# EAGLE design Adafruit USB Host FeatherWing (EAGLE 9.6.2)

## Sheet 1 of 2
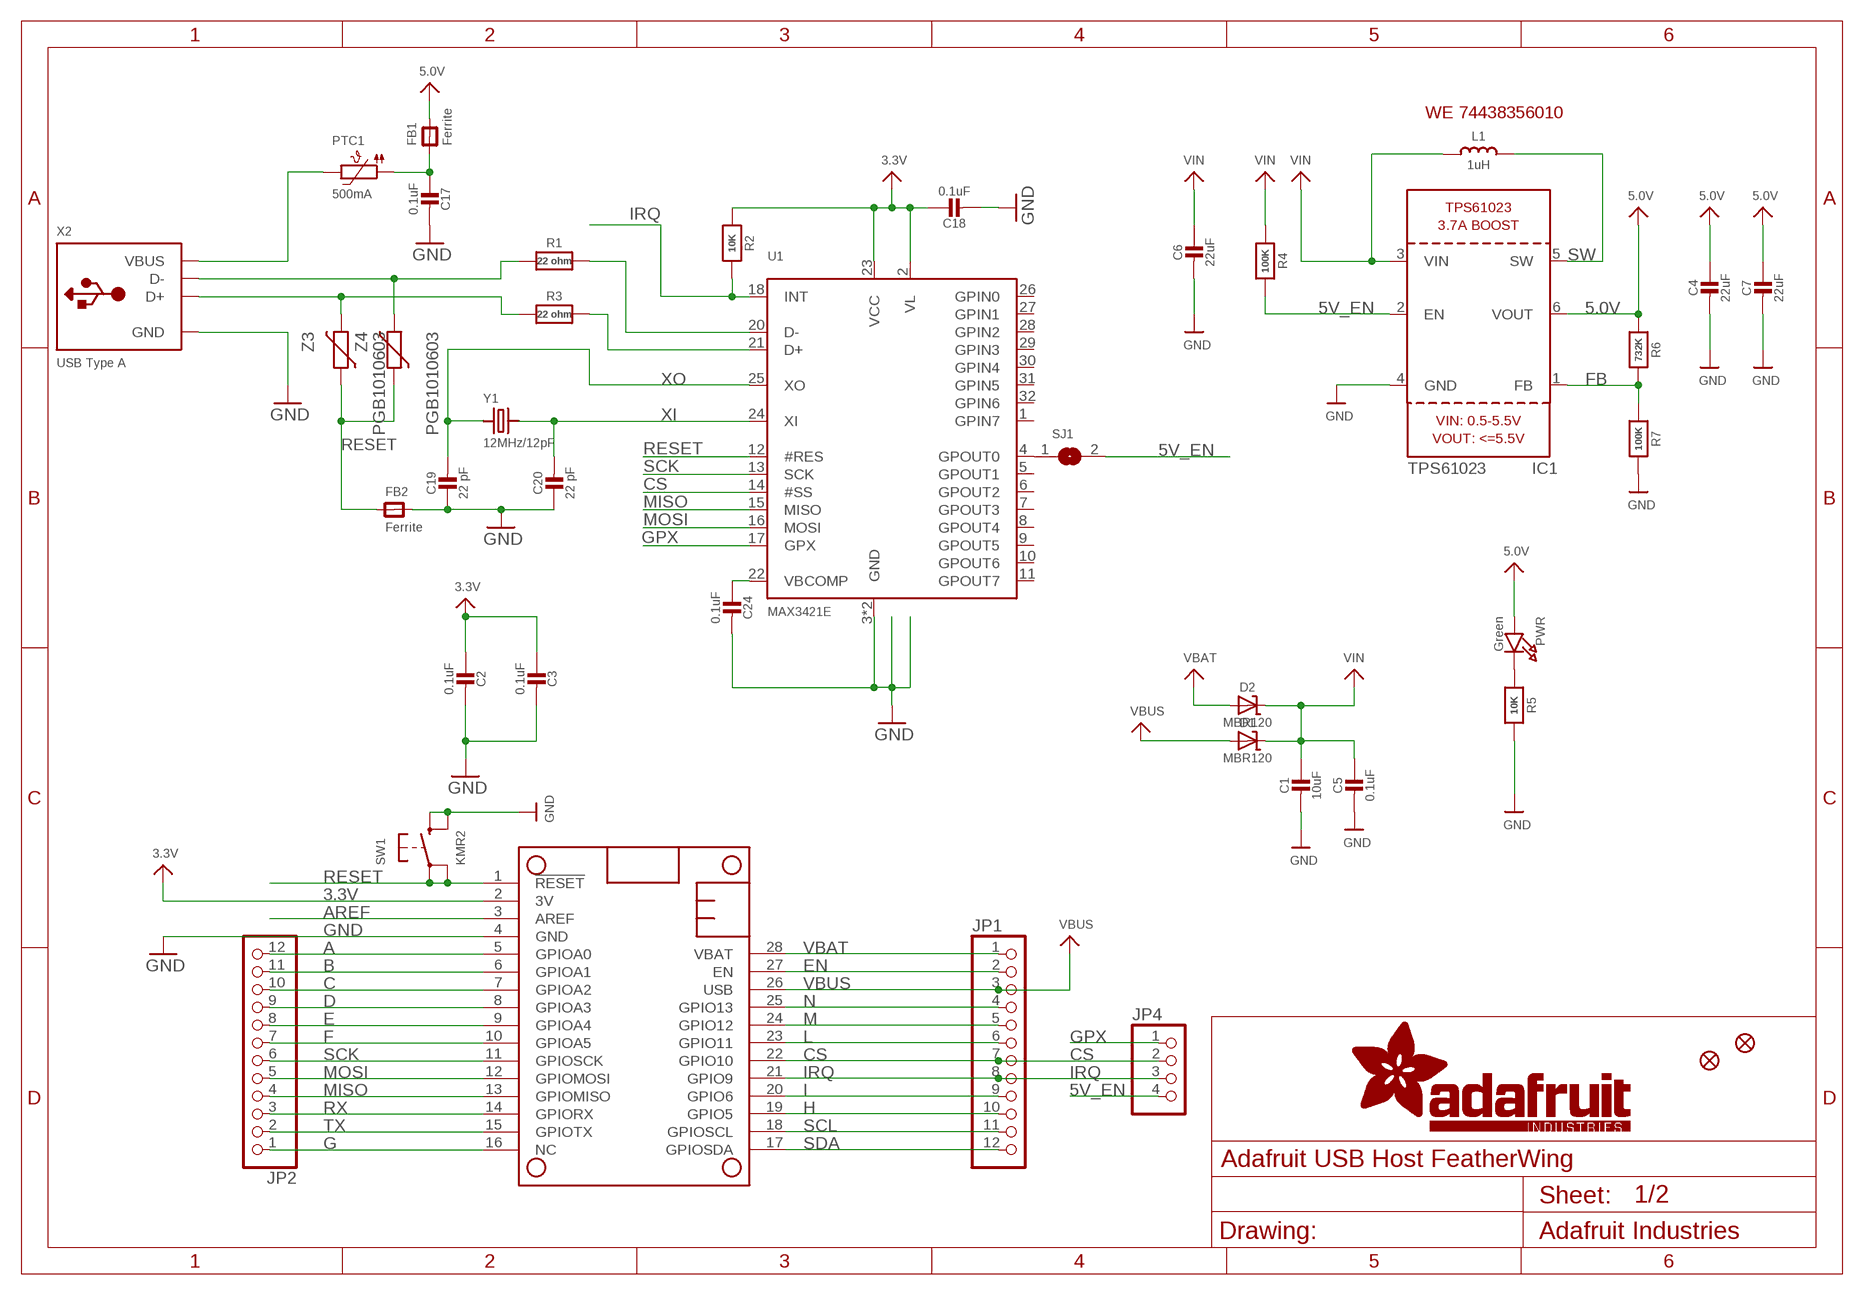
[diagram p0: schematic, sheet 1]

### Parts
C1  10uF  CAP_CERAMIC0805-NOOUTLINE  [0805-NO]
C2  0.1uF  CAP_CERAMIC0603_NO  [0603-NO]
C3  0.1uF  CAP_CERAMIC0603_NO  [0603-NO]
C4  22uF  CAP_CERAMIC0805-NOOUTLINE  [0805-NO]
C5  0.1uF  CAP_CERAMIC0603_NO  [0603-NO]
C6  22uF  CAP_CERAMIC0805-NOOUTLINE  [0805-NO]
C7  22uF  CAP_CERAMIC0805-NOOUTLINE  [0805-NO]
C17  0.1uF  CAP_CERAMIC0603_NO  [0603-NO]
C18  0.1uF  CAP_CERAMIC0603_NO  [0603-NO]
C19  22 pF  CAP_CERAMIC0603_NO  [0603-NO]
C20  22 pF  CAP_CERAMIC0603_NO  [0603-NO]
C24  0.1uF  CAP_CERAMIC0603_NO  [0603-NO]
D1  MBR120  DIODE-SCHOTTKYSOD-123  [SOD-123]
D2  MBR120  DIODE-SCHOTTKYSOD-123  [SOD-123]
FB1  Ferrite  FERRITE-0805NO  [0805-NO]
FB2  Ferrite  FERRITE-0805NO  [0805-NO]
FID1  FIDUCIAL_1MM  [FIDUCIAL_1MM]
FID2  FIDUCIAL_1MM  [FIDUCIAL_1MM]
IC1  TPS61023  [SOT563]
JP1  HEADER-1X12  [1X12_ROUND]
JP2  HEADER-1X1276MIL  [1X12_ROUND_76MIL]
JP4  HEADER-1X4ROUND  [1X04_ROUND]
L1  1uH  INDUCTOR_5045_SMALLTABS  [INDUCTOR_5045_SMALLTABS]
MS1  FEATHERWING_NODIM  [FEATHERWING_NODIM]
PTC1  500mA  PTC_0805  [0805-NO]
PWR  Green  LED0603_NOOUTLINE  [CHIPLED_0603_NOOUTLINE]
R1  22 ohm  RESISTOR_0603_NOOUT  [0603-NO]
R2  10K  RESISTOR_0603_NOOUT  [0603-NO]
R3  22 ohm  RESISTOR_0603_NOOUT  [0603-NO]
R4  100K  RESISTOR_0603_NOOUT  [0603-NO]
R5  10K  RESISTOR_0603_NOOUT  [0603-NO]
R6  732K  RESISTOR_0603_NOOUT  [0603-NO]
R7  100K  RESISTOR_0603_NOOUT  [0603-NO]
SJ1  SOLDERJUMPER  [SOLDERJUMPER_ARROW_NOPASTE]
SW1  KMR2  SWITCH_TACT_SMT4.6X2.8  [BTN_KMR2_4.6X2.8]
U1  MAX3421E  MAX3421E_QFP  [PQFP32_5X5MM]
X2  USB Type A  USB_TYPEA_SMT  [USB_HOST-SMT]
Y1  12MHz/12pF  CRYSTAL2.5X2.0  [CRYSTAL_2.5X2]
Z3  PGB1010603  VARISTORCN0603  [CT/CN0603]
Z4  PGB1010603  VARISTORCN0603  [CT/CN0603]

### Nets
3.3V: C2.1 C3.1 C18.1 MS1.2(3V) R2.1 U1.2(VL) U1.23(VCC)
5.0V: C4.1 C7.1 FB1.2 IC1.6(VOUT) PWR.A R6.1
5V_EN: IC1.2(EN) JP4.4 R4.2 SJ1.2
A: JP2.12 MS1.5(GPIOA0)
AREF: MS1.3(AREF)
B: JP2.11 MS1.6(GPIOA1)
C: JP2.10 MS1.7(GPIOA2)
CS: JP1.7 JP4.2 MS1.22(GPIO10) U1.14(#SS)
D: JP2.9 MS1.8(GPIOA3)
E: JP2.8 MS1.9(GPIOA4)
EN: JP1.2 MS1.27(EN)
F: JP2.7 MS1.10(GPIOA5)
FB: IC1.1(FB) R6.2 R7.1
G: JP2.1 MS1.16(NC)
GND: C1.2 C2.2 C3.2 C4.2 C5.2 C6.2 C7.2 C17.2 C18.2 C19.1 C20.1 C24.2 FB2.2 IC1.4(GND) MS1.4(GND) R5.2 R7.2 SW1.B'(S1) SW1.B(S) U1.3(GND) U1.19(GND) X2.GND
GPX: JP4.1 U1.17(GPX)
H: JP1.10 MS1.19(GPIO5)
I: JP1.9 MS1.20(GPIO6)
IRQ: JP1.8 JP4.3 MS1.21(GPIO9) R2.2 U1.18(INT)
L: JP1.6 MS1.23(GPIO11)
M: JP1.5 MS1.24(GPIO12)
MISO: JP2.4 MS1.13(GPIOMISO) U1.15(MISO)
MOSI: JP2.5 MS1.12(GPIOMOSI) U1.16(MOSI)
N: JP1.4 MS1.25(GPIO13)
N$1: C24.1 U1.22(VBCOMP)
N$2: SJ1.1 U1.4(GPOUT0)
N$3: FB2.1 Z3.1 Z4.1
N$5: PWR.C R5.1
N$26: R1.1 X2.D- Z4.2
N$27: R3.1 X2.D+ Z3.2
N$28: R1.2 U1.20(D-)
N$29: R3.2 U1.21(D+)
N$32 [power usb]: PTC1.2 X2.VBUS
N$33 [power usb]: C17.1 FB1.1 PTC1.1
RESET: MS1.1(!RESET) SW1.A'(P1) SW1.A(P) U1.12(#RES)
RX: JP2.3 MS1.14(GPIORX)
SCK: JP2.6 MS1.11(GPIOSCK) U1.13(SCK)
SCL: JP1.11 MS1.18(GPIOSCL)
SDA: JP1.12 MS1.17(GPIOSDA)
SW: IC1.5(SW) L1.2
TX: JP2.2 MS1.15(GPIOTX)
VBAT: D2.A JP1.1 MS1.28(VBAT)
VBUS: D1.A JP1.3 MS1.26(USB)
VIN: C1.1 C5.1 C6.1 D1.C D2.C IC1.3(VIN) L1.1 R4.1
XI: C20.2 U1.24(XI) Y1.3
XO: C19.2 U1.25(XO) Y1.1
Unconnected: U1.1(GPIN7) U1.5(GPOUT1) U1.6(GPOUT2) U1.7(GPOUT3) U1.8(GPOUT4) U1.9(GPOUT5) U1.10(GPOUT6) U1.11(GPOUT7) U1.26(GPIN0) U1.27(GPIN1) U1.28(GPIN2) U1.29(GPIN3) U1.30(GPIN4) U1.31(GPIN5) U1.32(GPIN6)

### Notes on the sheet
- WE 74438356010

## Sheet 2 of 2

## Library data of the parts
C1-C7 C17-C20 C24 = microbuilder:CAP_CERAMIC: Ceramic Capacitors For new designs, use the packages preceded by an '_' character since they are more reliable: The following footprints should be used on most boards: _0402 - Standard footprint for regular board layouts _0603 - Standard footprint for regular board layouts _0805 - Standard footprint for regular board layouts _1206 - Standard footprint for regular board layouts For extremely tight-pitch boards where space is at a premium, the following 'micro-pitch' footprints can be used (smaller pads, no silkscreen outline, etc.): _0402MP - Micro-pitch footprint for very dense/compact boards _0603MP - Micro-pitch footprint for very dense/compact boards _0805MP - Micro-pitch footprint for very dense/compact boards _1206MP - Micro-pitch footprint for very dense/compact boards
D1 D2 = microbuilder:DIODE-SCHOTTKY
FB1 FB2 = microbuilder:FERRITE: Ferrite Bead 0603 MMZ1608B121C - 120 Ohm @ 100MHz, 600mA, 0.15 Ohm DC Resistance - Digikey: 445-2164-1-ND BK1608HW121-T - 120 Ohm, 600mA Ferrite Chip - Digikey: 587-1876-2-ND 0805 HZ0805B272R-10 - 2.7K Ohm @ 100MHz, 200mA, 0.8 Ohm DC Resistance - Digikey: 240-2504-1-ND (see also Murata BLM21BD272SN1L) MMZ2012Y152B - 1.5K Ohm @ 100MHz, 500mA, 0.4 Ohm DC Resistance - Digikey: 445-1560-1-ND - Mainly for high frequency (80-400MHz) MMZ2012R102A - 1K Ohm @ 100MHz, 500mA, 0.3 Ohm DC Resistance - Digikey: 445-1555-2-ND - More general purpose (10-200MHz)
FID1 FID2 = microbuilder:FIDUCIAL: Fiducial Alignment Points Various fiducial points for machine vision alignment.; BOM: EXCLUDE
IC1 = adafruit_power:TPS61023; ROT: 180
JP1 JP2 = microbuilder:HEADER-1X12
JP4 = microbuilder:HEADER-1X4: PIN HEADER
L1 = microbuilder:INDUCTOR: Inductors 0603: 10nH Ceramic Inductor - microwire antenna/RF (Digikey: 712-1434-2-ND) 0805: 560nH Ceramic Inductor - RF (Digikey: 553-1047-1-ND) 270nH Ceramic Inductor - Q = 40@250MHz, +-5%, 1 Ohm DC Resistance (Digikey: 535-10506-2-ND) 1007 (2518 Metric) SMT: 10µH 10% 250mOhm 820mA 1007 Inductor (Digikey: 587-2189-1-ND) 22µH 10% 500mOhm 580mA 1007 Inductor (Digikey: 587-2190-1-ND) 47µH 10% 950mOhm 420mA 1007 Inductor (Digikey: 587-2191-1-ND) 47µH 5% 100mOhm 1A 1008 Inductor (Digikey: 732-1816-1-ND) 5.0x5.0mm (Taiyo Yuden NR5040 Series) 6.8µH 20% 2.3A 64mOhm Inductor (Digikey: 587-2374-2-ND) 5.0x5.0mm (TDK VLC5045 Series) 4.7µH 20% 3.3A 34mOhm Inductor (Digikey: 445-6526-1-ND) 6.8µH 20% 2.7A 46mOhm Inductor (Digikey: 445-6527-1-ND) 6.0x6.0mm (TDK VLC6045 Series) 4.7µH 20% 3.8A 27mOhm Inductor (Digikey: 445-6538-2-ND) 6.8µH 20% 3A 41mOhm Inductor (Digikey: 445-6540-1-ND) 6.2µH 30% 2.2A 45mOhm Inductor (Digikey: SRR5028-6R2YCT-ND) - Not TDK VLC6045 but footprint should match 6.0x6.0mm (TDK SLF6045 Series) 6.8uH 30% 2A 33mOhm Inductor (Digikey: 445-4572-1-ND, Mouser: 810-SLF645T6R8N2R0PF) 6.0x6.0mm (Sumida CDRH5D28 Series) 6.2uH 30% 1.8A 45mOhm Inductor (Digikey: 308-1542-1-ND) Taiyo Yuden NR3015T2R2M - 2.2uH 20% 1.5A (Digikey: 587-1648-2-ND, Mouser: 963-NR3015T2R2M) - Used with TI TPS62172 CoilCraft RFID Transponder Coil - MA5532-AE (For use with AS3935 Lightning Sensor) Taiyo Yuden NRH2412T2R2MNGH - 2.2uH 20% 1AA (Digikey: 587-3443-1-ND) - Used with TI LM3671 Vishay IHLP 1.0uH Molded Inductor - 24mOhm DCR, 5A, +/-20%, -55°C-125°C (Digikey: 541-1319-1-ND)
MS1 = microbuilder:FEATHERWING
PTC1 = microbuilder:PTC: PTC (Resettable Fuse) 1206 Package 250mA PTC (16V Max, Time-to-Trip: 0.08s) - Digikey: F2110CT-ND 1210 Package 100mA PTC (30V Max, Time-to-Trip: 0.6s) - Digikey: MF-USMF010-2CT-ND 1812 Package 750mA PTC (24V Max, Time-to-Trip: 0.2s) - Digikey: MF-MSMF075/24-2CT-ND
PWR = microbuilder:LED: LED 0603 - 0603 Surface Mount Package 2mA: Green LED - Low Power (3.9mcd, 2ma, 1.7Vf) - Digikey: 475-2709-2-ND Orange LED - Low Power (9.8mcd, 2ma, 1.8Vf) - Digikey: 475-1194-2-ND Red LED - Low Power (5mcd, 2ma, 1.8Vf) - Digikey: 475-1195-2-ND Yellow LED - Low Power (7mcd, 2ma, 1.8Vf) - Digikey: 475-1196-2-ND 5mA: Blue LED - Low Power (17mcd, 5ma, 2.9Vf) - Digikey: LNJ937W8CRACT-ND 0805 - 0805 Surface Mount Package 2mA: Red LED (8.8mcd, 2mA, 1.8Vf, Clear) - Low Power [Digikey: 475-2510-1-ND] Green LED (5mcd, 2mA, 1.8Vf, Clear) - Low Power [Digikey: 475-2730-1-ND] Yellow LED (11.3mcd, 2mA, 1.8Vf, Clear) - Low Power [Digikey: 475-2555-1-ND] 20mA: Red LED (104mcd, 20mA, Diffused) - LS R976 [Digikey: 475-1278-6-ND] Red LED (12mcd, 20mA, 2.0Vf, Clear) - APT2012EC [Digikey: 754-1128-1-ND] Green LED (15mcd, 20mA, 2.2Vf, Clear) - APT2012GC [Digikey: 754-1131-1-ND] Orange LED (160mcd, 20mA, 2.1Vf, Clear) - APT2012SECK [Digikey: 754-1130-1-ND] 1206 - 1206 Surface Mount Package Green LED (26mcd, 20mA, Diffused) - LG N971 [Digikey: 475-1407-6-ND] Red LED (15mcd, 20mA, Diffused) - LH N974 [Digikey: 475-1416-6-ND] Cree - Cree High-Power Surface Mount LEDs XPEBWT-L1-0000-00D50 - White 111lm 350mA 2.9Vf 6200K 110° XTEAWT-00-0000-00000LEE3 - White 114lm 350mA 2.85Vf 5000K 115° Everlight - Everlight 45-21 Series Surface Mount LEDs 45-21/QK2C-B2832AC2CB2/2T - Warm White 2000mcd 20mA 3.25Vf 3050K 120° 45-21/LK2C-B38452C4CB2/2T - Nuetral White 2000mcd 20mA 3.25Vf 4150K 120° 45-21/LK2C-B50634C6CB2/2T - Cold White 2200mcd 20mA 3.25Vf 5650K 120° PLCC2 Reverse Mount LS T77K-J1L2-1-0-2-R18-Z - Red 11.25mcd 2mA 1.8Vf 630nm 120° LO T77K-L1M2-24-Z - Orange 19.6mcd 2mA 1.8Vf 606nm 120° LY T77K-K2M1-26-Z - Yellow 15.7mcd 2mA 1.8Vf 587nm 120°; ROT: 270
R1-R7 = microbuilder:RESISTOR: Resistors For new designs, use the packages preceded by an '_' character since they are more reliable: The following footprints should be used on most boards: _0402 - Standard footprint for regular board layouts _0603 - Standard footprint for regular board layouts _0805 - Standard footprint for regular board layouts _1206 - Standard footprint for regular board layouts For extremely tight-pitch boards where space is at a premium, the following 'micro-pitch' footprints can be used (smaller pads, no silkscreen outline, etc.): _0402MP - Micro-pitch footprint for very dense/compact boards _0603MP - Micro-pitch footprint for very dense/compact boards _0805MP - Micro-pitch footprint for very dense/compact boards _1206MP - Micro-pitch footprint for very dense/compact boards
SJ1 = microbuilder:SOLDERJUMPER: SMD Solder JUMPER Solder the two pads together to create a connection, or remove the solder to break it. REFLOW - Use this footprint for solder paste and reflow ovens. WAVE - Use this footprint for hand-soldering (larger pads). CLOSED - Has a trace between the two pads to ensure it is closed by default. The trace needs to be cut to disable the jumper, and can be closed again by creating a solder bridge between the two pads.; BOM: EXCLUDE
SW1 = microbuilder:SWITCH_TACT_SMT: SMT Tact Switches 6x6mm - Digikey: P12940SCT-ND KMR2 (4.6x2.8mm) - Digikey: 401-1426-1-ND EVQ-PQHB55 - Light Touch, 160GF (4.5x4.5mm) - Digikey: P8090SCT-ND KMT0 - KMT021 NGJ LHS (etc.) IP68/Waterproof - Digikey: CKN10289CT-ND
U1 = microbuilder:MAX3421E: MAX3421E SPI-Interface USB Device/Host Controller Digikey: MAX3421EETJ+-ND
X2 = adafruit_electromech:USB_TYPEA: USB - Type A Connectors Male types stick out and are inserted into a PC or matching females parts (these are the connectors used on USB Memory Sticks, etc.). Female parts are generally used for USB Host and accept a male-type connector. SMT - 4UCON: 10017 PTHFML - Digikey: 609-1045-ND, 4UCon: 05241 PCB - Use 2.0mm thick PCBs with this footprint
Y1 = microbuilder:CRYSTAL: Crystals HC49UP - Surface Mount Crystal 4.0MHz 18pF +/-30ppm Surface Mount Crystal [Digikey: 535-9857-1-ND] 12.0 MHz Surface Mount Crystal [Digikey: 535-9869-6-ND] 25.0 MHz Surface Mount Crystal [Digikey: 535-9078-1-ND] 2.5 x 2.0mm - MEMs SMT Crystal 16.0 MHz 10pF 20ppm 2.5 x 2.0mm Crystal [Digikey -40-85°C: 535-10923-1-ND] 3.2 x 2.5mm - MEMs SMT Crystal 12.0 MHz 8pF 15ppm 3.2 x 2.5mm Crystal [Digikey: -10-70°C: 644-1047-1-ND -40-125°C: 644-1128-1-ND] 40~85°C cheaper: 644-1173-6-ND 16.0 MHz 8pF 15ppm 3.2 x 2.5mm Crystal [Digikey: -10-70°C: 644-1049-1-ND -40-125°C: 644-1129-2-ND]-40~85°C cheaper: 644-1175-6-ND 16.0 MHz 10pF 10ppm 3.2 x 2.5mm Crystal [Digikey: 644-1100-1-ND] 27.12 MHz 18pF 30ppm 3.2 x 2.5mm Crystal [Digikey: 887-1424-1-ND] 27.12MHz 10pF 10ppm 3.2 x 2.5mm Crystal [Digikey: 887-1329-1-ND] 4.9 x 1.8mm - MEMs SMT Crystal 32.768 KHz 12.5pF 20ppm 4.9 x 1.8mm Crystal [Digikey: SE2415CT-ND] 8.0 x 3.8mm - Surface Mount Crystal 32.768kHz 12.5pF 20ppm -40°C-85°C [Digikey: 535-9166-2-ND] Cylinder 32.768KHz Cylinder Crystal (2x6mm body) [Ex. Digikey: 300-8341-2-ND]
Z3 Z4 = varistor:VARISTOR: VARISTOR

## Net classes
1 power: width 0.254 mm, drill 0.584 mm, clearance 0.203 mm
2 gnd: width 0.254 mm, drill 0.584 mm, clearance 0.203 mm
3 power usb: width 0.254 mm, drill 0.584 mm, clearance 0.254 mm
5 +5v: width 0.254 mm, drill 0.584 mm, clearance 0.203 mm

## Board
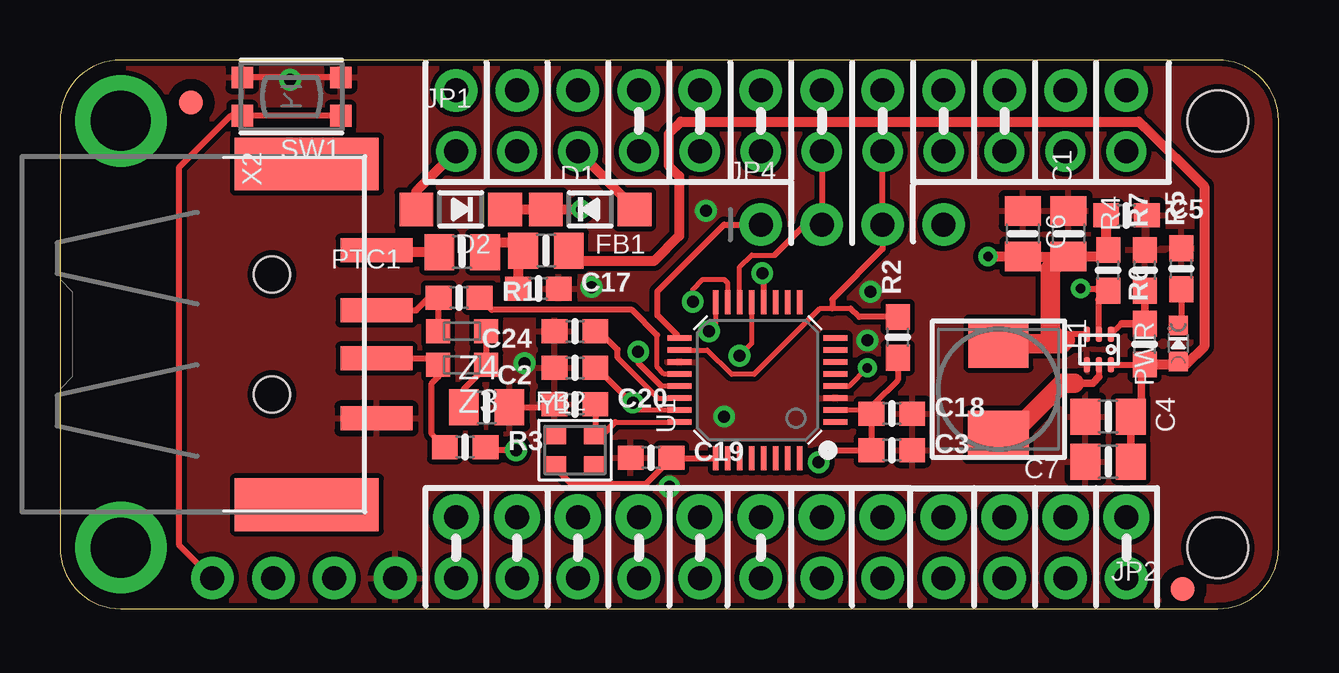
[diagram p1: board, top side]
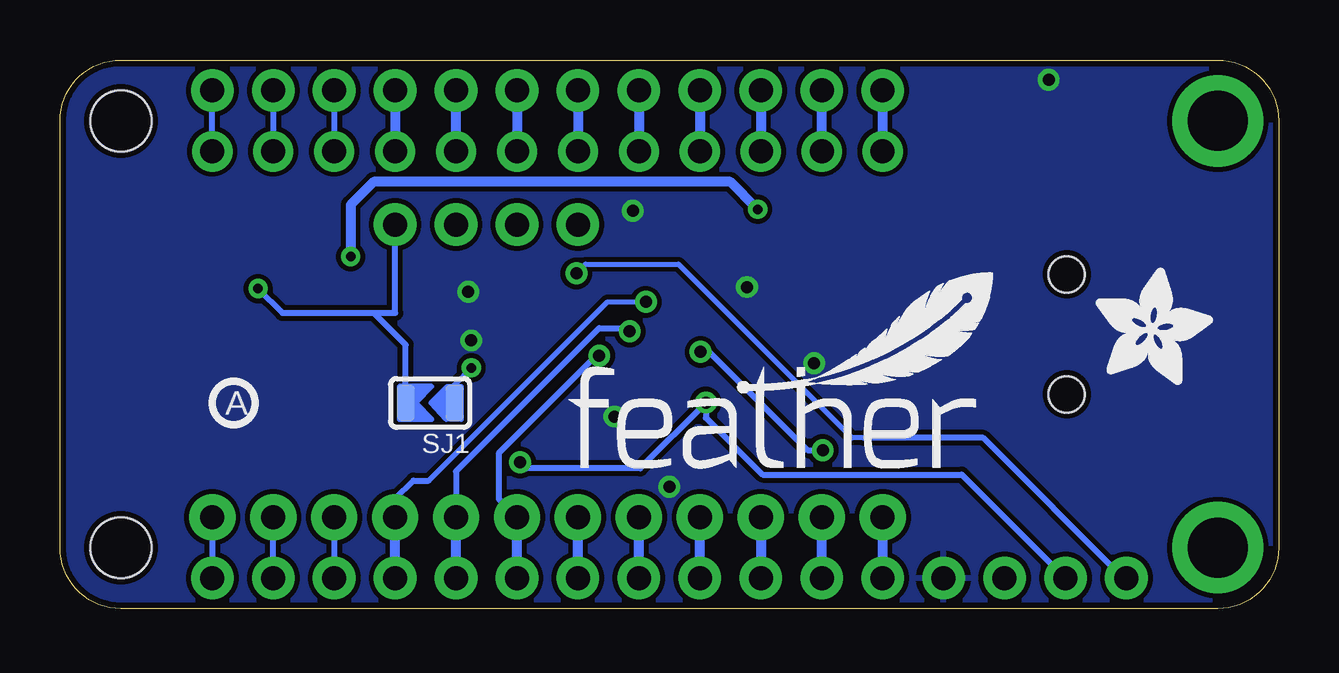
[diagram p2: board, bottom side, seen from below]

Size 50.8 x 22.86 mm. Coordinates in mm from the lower left corner, seen from the top.
Outline: 48.26,22.86 2.54,22.86 arc90 0,20.32 0,2.54 arc90 2.54,0 48.26,0 arc90 50.8,2.54 50.8,20.32 arc90 48.26,22.86
Copper layers (1*16): Top 0.035mm / dielectric 1.5mm / Bottom 0.035mm
Design rules "adafruit *": minimum track width 8mil, minimum drill 15.5mil, track to track 8mil, track to pad 8mil, pad to pad 8mil, via to via 8mil, smd to smd 8mil, copper to edge 10mil, drill to drill 8mil, minimum pad ring 10mil, minimum via ring 8mil, stop-mask expansion 2mil, vias tented up to drill 20mil, thermal gap 10mil

### Footprints (pad centres in the part's own frame; a part is rotated, then mirrored left to right if it is on the bottom)
0805-NO = smd 1.24 x 1.5: 1 -0.95,0; 2 0.95,0
0603-NO = smd 1.075 x 1: 1 -0.85,0; 2 0.85,0
SOD-123 = smd 1.4 x 1.4: A 1.85,0; C -1.85,0
FIDUCIAL_1MM = smd 1 x 1: 1 0,0
SOT563 = smd 0.65 x 0.275: 1 -0.635,0.5; 2 -0.635,0; 3 -0.635,-0.5; 4 0.635,-0.5; 5 0.635,0; 6 0.635,0.5
1X12_ROUND = drill 1 pad 1.676: 1 -13.97,0; 2 -11.43,0; 3 -8.89,0; 4 -6.35,0; 5 -3.81,0; 6 -1.27,0; 7 1.27,0; 8 3.81,0; 9 6.35,0; 10 8.89,0; 11 11.43,0; 12 13.97,0
1X12_ROUND_76MIL = drill 1 pad 1.93: 1 -13.97,0; 2 -11.43,0; 3 -8.89,0; 4 -6.35,0; 5 -3.81,0; 6 -1.27,0; 7 1.27,0; 8 3.81,0; 9 6.35,0; 10 8.89,0; 11 11.43,0; 12 13.97,0
1X04_ROUND = drill 1 pad 1.778: 1 -3.81,0; 2 -1.27,0; 3 1.27,0; 4 3.81,0
INDUCTOR_5045_SMALLTABS = smd 2 x 2.5: 1 -1.9,0 | smd 2 x 2.55: 2 1.9,0
FEATHERWING_NODIM = drill 1 pad 1.778: 1 6.35,1.27; 2 8.89,1.27; 3 11.43,1.27; 4 13.97,1.27; 5 16.51,1.27; 6 19.05,1.27; 7 21.59,1.27; 8 24.13,1.27; 9 26.67,1.27; 10 29.21,1.27; 11 31.75,1.27; 12 34.29,1.27; 13 36.83,1.27; 14 39.37,1.27; 15 41.91,1.27; 16 44.45,1.27; 17 44.45,21.59; 18 41.91,21.59; 19 39.37,21.59; 20 36.83,21.59; 21 34.29,21.59; 22 31.75,21.59; 23 29.21,21.59; 24 26.67,21.59; 25 24.13,21.59; 26 21.59,21.59; 27 19.05,21.59; 28 16.51,21.59 | drill 2.5 pad 3.81: P$1 2.54,20.32; P$2 2.54,2.54 | hole 2.54: 48.26,20.32; 48.26,2.54
CHIPLED_0603_NOOUTLINE = smd 0.8 x 0.8: A 0,-0.75; C 0,0.75
SOLDERJUMPER_ARROW_NOPASTE = smd 0.762 x 1.524: 1 -1.016,0; 2 1.016,0
BTN_KMR2_4.6X2.8 = smd 0.9 x 0.9: A 2.05,0.8; A' -2.05,0.8; B 2.05,-0.8; B' -2.05,-0.8
PQFP32_5X5MM = smd 0.23 x 1: 1 -1.75,-3.25; 2 -1.25,-3.25; 3 -0.75,-3.25; 4 -0.25,-3.25; 5 0.25,-3.25; 6 0.75,-3.25; 7 1.25,-3.25; 8 1.75,-3.25; 17 1.75,3.25; 18 1.25,3.25; 19 0.75,3.25; 20 0.25,3.25; 21 -0.25,3.25; 22 -0.75,3.25; 23 -1.25,3.25; 24 -1.75,3.25 | smd 1 x 0.23: 9 3.25,-1.75; 10 3.25,-1.25; 11 3.25,-0.75; 12 3.25,-0.25; 13 3.25,0.25; 14 3.25,0.75; 15 3.25,1.25; 16 3.25,1.75; 25 -3.25,1.75; 26 -3.25,1.25; 27 -3.25,0.75; 28 -3.25,0.25; 29 -3.25,-0.25; 30 -3.25,-0.75; 31 -3.25,-1.25; 32 -3.25,-1.75
USB_HOST-SMT = smd 1 x 3: D+ 1,0.495; D- -1,0.495; GND 3.5,0.495; VBUS -3.5,0.495 | smd 2.2 x 6: MT1 -7.1,-2.413; MT2 7.1,-2.413 | hole 1.5: -2.5,-3.863; 2.5,-3.863
CRYSTAL_2.5X2 = smd 0.9 x 0.75: 1 -0.825,-0.625; 2 0.825,-0.625; 3 0.825,0.625; 4 -0.825,0.625
CT/CN0603 = smd 1 x 1: 1 -1,0; 2 1,0

### Placement (x,y rotation side)
C1  42.04,15.62 90 top
C2  21.46,10.03 180 top
C3  34.67,6.6 0 top
C4  43.69,8 180 top
C5  44.45,16.38 0 top
C6  40.13,15.62 90 top
C7  43.69,6.12 180 top
C17  19.94,13.34 0 top
C18  34.67,8.13 0 top
C19  24.64,6.29 0 top
C20  21.46,8.51 0 top
C24  21.46,11.56 180 top
D1  22.1,16.64 0 top
D2  16.7,16.64 180 top
FB1  20.26,14.92 0 top
FB2  17.78,8.38 0 top
FID1  5.46,21.08 0 top
FID2  46.8,0.83 0 top
IC1  43.31,10.79 270 top
JP1  30.48,19.05 0 top
JP2  30.48,3.81 180 top
JP4  33.02,16 0 top
L1  39.12,9.14 270 top
MS1  0,0 0 top
PLABEL0  [PLABEL0]  5.78,2.34 0 top
PLABEL1  [PLABEL1]  8.01,2.27 0 top
PLABEL2  [PLABEL2]  12.88,2.4 0 top
PLABEL3  [PLABEL3]  18.41,20 0 top
PLABEL4  [PLABEL4]  15.62,20 0 top
PLABEL5  [PLABEL5]  20.79,20 0 top
PLABEL6  [PLABEL6]  43.62,20 0 top
PLABEL7  [PLABEL7]  41.27,20 0 top
PLABEL8  [PLABEL8]  41.21,2.22 0 top
PLABEL9  [PLABEL9]  38.93,2.22 0 top
PLABEL10  [PLABEL10]  36.13,2.22 0 top
PLABEL11  [PLABEL11]  33.4,2.22 0 top
PLABEL12  [PLABEL12]  31.04,2.21 0 top
PLABEL13  [PLABEL13]  13.65,20.07 90 top
PLABEL14  [PLABEL14]  29.02,14.41 0 top
PLABEL15  [PLABEL15]  31.94,14.41 0 top
PLABEL16  [PLABEL16]  34.48,14.41 0 top
PLABEL17  [PLABEL17]  37.02,14.41 0 top
PLABEL18  [PLABEL18]  49.02,11.43 90 top
PLABEL19  [PLABEL19]  46.61,8.95 90 top
PLABEL20  [PLABEL20]  50.67,10.35 0 bottom
PLABEL21  [PLABEL21]  50.86,5.71 0 bottom
PTC1  16.76,14.86 180 top
PWR  46.61,11.05 0 top
R1  16.64,12.95 0 top
R2  34.92,11.3 90 top
R3  16.89,6.73 0 top
R4  43.69,14.1 270 top
R5  46.74,14.16 90 top
R6  45.21,11.02 90 top
R7  45.21,14.1 90 top
SJ1  35.37,8.57 180 bottom
SW1  9.65,21.34 180 top
U1  29.08,9.53 90 top
U$20  [FEATHERLOGO_MED]  29.72,5.78 0 bottom
U$22  [ADAFRUIT_5MM]  7.62,9.33 0 bottom
U$26  [PCBFEAT-REV-040]  43.56,8.57 0 bottom
X2  12.7,11.43 270 top
Y1  21.46,6.6 0 top
Z3  16.76,10.16 180 top
Z4  16.76,11.56 180 top

### Tracks (layer width: path | path; a pad name or v marks a point on that pad's centre or on a via)
3.3V  (via drill 0.5)
  Top 0.203: C18.1 33.67,8.28 U1.2 | U1.23 23.88,8.28
  Top 0.254: 23.88,8.28 v23.88,8.59 23.82,8.59 22.37,10.03 C2.1 | v31.62,6.1 32.13,6.6 C3.1 C18.1 33.82,7.99 33.95,8.12 33.95,8.55 34.92,9.53 R2.1
  Bottom 0.254: MS1.2 13.21,5.59 21.52,5.59 23.88,7.95 v23.88,8.59 26.62,5.84 31.37,5.84 v31.62,6.1
5.0V
  Top 0.254: IC1.6 45.07,10.16 | PWR.A 46.75,10.16 46.93,10.16
  Top 0.305: 45.07,10.03 R6.1 | 45.07,10.03 45.07,8.43 C4.1 C7.1 | 45.07,10.03 45.07,10.16
  Top 0.406: R6.1 45.23,10.16 46.93,10.16 47.69,10.92 47.69,17.59 45.21,20.07 45.19,20.07 44.97,20.3 25.88,20.3 25.37,19.79 25.37,19.57 25.38,19.57 25.38,18.45 25.81,18.02 25.81,15.53 24.76,14.48 21.65,14.48 FB1.2
5V_EN  (via drill 0.39)
  Top 0.254: IC1.2 43.31,12.87 | v42.55,13.34 43.18,13.34 43.48,13.04
  Top 0.305: 43.31,12.87 43.48,13.04 R4.2
  Bottom 0.254: v42.55,13.34 41.53,12.32 37.72,12.32 | 37.72,12.32 36.83,12.32 JP4.4 | SJ1.2 36.39,10.99 37.72,12.32
A
  Bottom 0.406: JP2.12 MS1.5
B
  Bottom 0.406: MS1.6 JP2.11
C
  Bottom 0.406: JP2.10 MS1.7
CS
  Top 0.203: U1.14 28.33,14.24 28.83,14.73 29.78,14.73
  Top 0.254: 29.78,14.73 31.05,16 JP4.2 JP1.7
  Bottom 0.406: MS1.22 JP1.7
D
  Bottom 0.406: MS1.8 JP2.9
E
  Bottom 0.406: MS1.9 JP2.8
EN
  Bottom 0.406: JP1.2 MS1.27
F
  Bottom 0.406: MS1.10 JP2.7
FB
  Top 0.254: IC1.1 44.25,11.87
  Top 0.305: 44.25,11.87 R6.2 R7.1
G
  Bottom 0.254: JP2.1 MS1.16
GND  (via drill 0.5)
  Top 0.254: SW1.B' SW1.B | FB2.2 20.49,8.38 C20.1
  other vias: 26.92,16.57 33.66,11.18 33.78,13.21 25.4,5.08 19.37,10.22 22.16,13.4 9.59,22.03 27.69,8
  pour Top: 0,22.86 50.8,22.86 50.8,0 0,0
  pour Bottom: 0,0 50.8,0 50.8,22.86 0,22.86
GPX
  Top 0.203: U1.17 25.73,11.37 25.73,11.38
  Top 0.254: JP4.1 27.69,16 24.9,13.22 24.9,12.22 25.73,11.38
H
  Bottom 0.254: MS1.19 JP1.10
I
  Bottom 0.406: MS1.20 JP1.9
IRQ
  Top 0.203: U1.18 26.98,10.78 27.99,9.76 28.94,9.76 31.69,12.51 32.19,12.51 32.96,12.51
  Top 0.254: R2.2 33.31,12.15 32.96,12.51 | JP1.8 JP4.3 34.29,14.99 32.19,12.89 32.19,12.51
  Bottom 0.406: JP1.8 MS1.21
L
  Bottom 0.406: MS1.23 JP1.6
M
  Bottom 0.406: MS1.24 JP1.5
MISO  (via drill 0.5)
  Top 0.203: v26.38,12.79 26.38,13.29 26.8,13.72 27.69,13.72 27.83,13.57 27.83,12.95 U1.15
  Bottom 0.203: 35.43,5.33 27.98,12.79 v26.38,12.79
  Bottom 0.254: 35.43,5.33 36.07,5.33 36.83,4.57 JP2.4
  Bottom 0.406: MS1.13 JP2.4
MOSI  (via drill 0.5)
  Top 0.203: U1.16 27.33,11.84 v27.05,11.56
  Bottom 0.254: v27.05,11.56 27.18,11.68 28.32,11.68 34.29,5.71 JP2.5
  Bottom 0.406: MS1.12 JP2.5
N
  Bottom 0.406: MS1.25 JP1.4
N$1
  Top 0.203: 23.24,10.45 24.92,8.78 U1.22
  Top 0.254: 23.24,10.45 23.24,10.79 22.48,11.56 C24.1
N$2  (via drill 0.39)
  Top 0.203: U1.4 32.9,9.28 v33.66,10.03
  Bottom 0.203: v33.66,10.03 34.35,9.34 SJ1.1
N$3
  Top 0.254: Z4.1 Z3.1 17.76,10.08 16.83,9.14 FB2.1
N$5
  Top 0.254: R5.1 46.74,11.93 PWR.C
N$26
  Top 0.254: Z4.2 15.76,12.93 R1.1 15.37,12.95 14.85,12.43 X2.D-
N$27
  Top 0.254: R3.1 15.49,7.28 15.49,9.38 15.76,9.65 Z3.2 15.49,10.43 X2.D+
N$28
  Top 0.203: U1.20 25.19,9.78 24.89,10.07 24.89,11.4
  Top 0.254: 24.89,11.4 23.84,12.45 18,12.45 R1.2
N$29  (via drill 0.5)
  Top 0.203: U1.21 25.07,9.28
  Top 0.254: 25.07,9.28 24.1,10.25 v24.1,10.7 | v19.01,6.6 18.25,6.6 18.12,6.73 R3.2
  Bottom 0.254: v24.1,10.7 23.74,10.7 19.64,6.6 v19.01,6.6
N$32
  Top 0.406: PTC1.2 13.27,14.86 X2.VBUS
N$33
  Top 0.254: FB1.1 19.31,14.99 19.56,15.24
  Top 0.406: 19.56,15.24 18.09,15.24 PTC1.1 | FB1.1 19.09,14.71 C17.1
RESET  (via drill 0.5)
  Top 0.254: SW1.A' SW1.A 7.11,20.54 4.95,18.38 4.95,2.67 MS1.1 | v29.27,13.97 29.33,13.91 U1.12
  Bottom 0.203: 17.27,7.11 17.78,7.11 25.02,14.35 28.89,14.35 v29.27,13.97
  Bottom 0.254: 17.27,7.11 12.32,7.11 6.48,1.27 MS1.1
RX
  Bottom 0.254: JP2.3 MS1.14
SCK  (via drill 0.5)
  Top 0.203: U1.13 28.83,11.05 v28.32,10.54
  Top 0.254: v28.32,10.54
  Bottom 0.203: 28.45,10.53 28.33,10.53 v28.32,10.54
  Bottom 0.254: 28.45,10.53 32.51,6.46 32.51,4.57 JP2.6
  Bottom 0.406: MS1.11 JP2.6
SCL
  Bottom 0.254: MS1.18 JP1.11
SDA
  Bottom 0.254: JP1.12 MS1.17
SW
  Top 0.254: IC1.5 43.31,9.65
  Top 0.305: 42.29,9.4 43.05,9.4 43.31,9.65
  Top 0.813: 42.29,9.4 41.78,9.4 39.63,7.24 L1.2
TX
  Bottom 0.254: MS1.15 JP2.2
VBAT
  Top 0.406: JP1.1 14.85,17.39 D2.A
  Bottom 0.406: MS1.28 JP1.1
VBUS
  Top 0.406: JP1.3 23.95,16.69 D1.A
  Bottom 0.406: MS1.26 JP1.3
VIN  (via drill 0.39)
  Top 0.254: IC1.3 42.16,11.43 41.91,11.18
  Top 0.406: v38.68,14.67 C6.1 41.78,14.67 C1.1 43.41,14.67 R4.1 43.6,15.04 C5.1 | D2.C D1.C v21.72,16.64
  Top 0.813: 41.77,11.04 41.91,11.18 | L1.1 41.77,11.04 | 41.77,11.04 41.27,11.54 41.27,14.16 41.78,14.67
  Bottom 0.406: v21.72,16.64 22.86,17.78 37.72,17.78 38.68,16.82 v38.68,14.67
XI
  Top 0.203: 23.14,7.78 U1.24
  Top 0.254: 23.14,7.78 22.61,7.24 Y1.3 22.31,7.25 C20.2
XO
  Top 0.254: Y1.1 20.64,5.86 21.29,5.21 24.42,5.21 25.49,6.28 C19.2 25.5,6.28 U1.25

### Text on the board
Pinguin_tBackup: RST | bat | en | usb | scl | sda | GPX | CS | IRQ | 5V | MAX3421E USB / Host FeatherWing | 5V | rst | 3vo | gnd | sck | mo | mi | rx | tx
Pinguin_bBackup: MAX3421E / USB Host / FeatherWing | Uses SPI pins, CS, IRQ